# Altium schematic sheet 双电机驱动.SchDoc
size A3
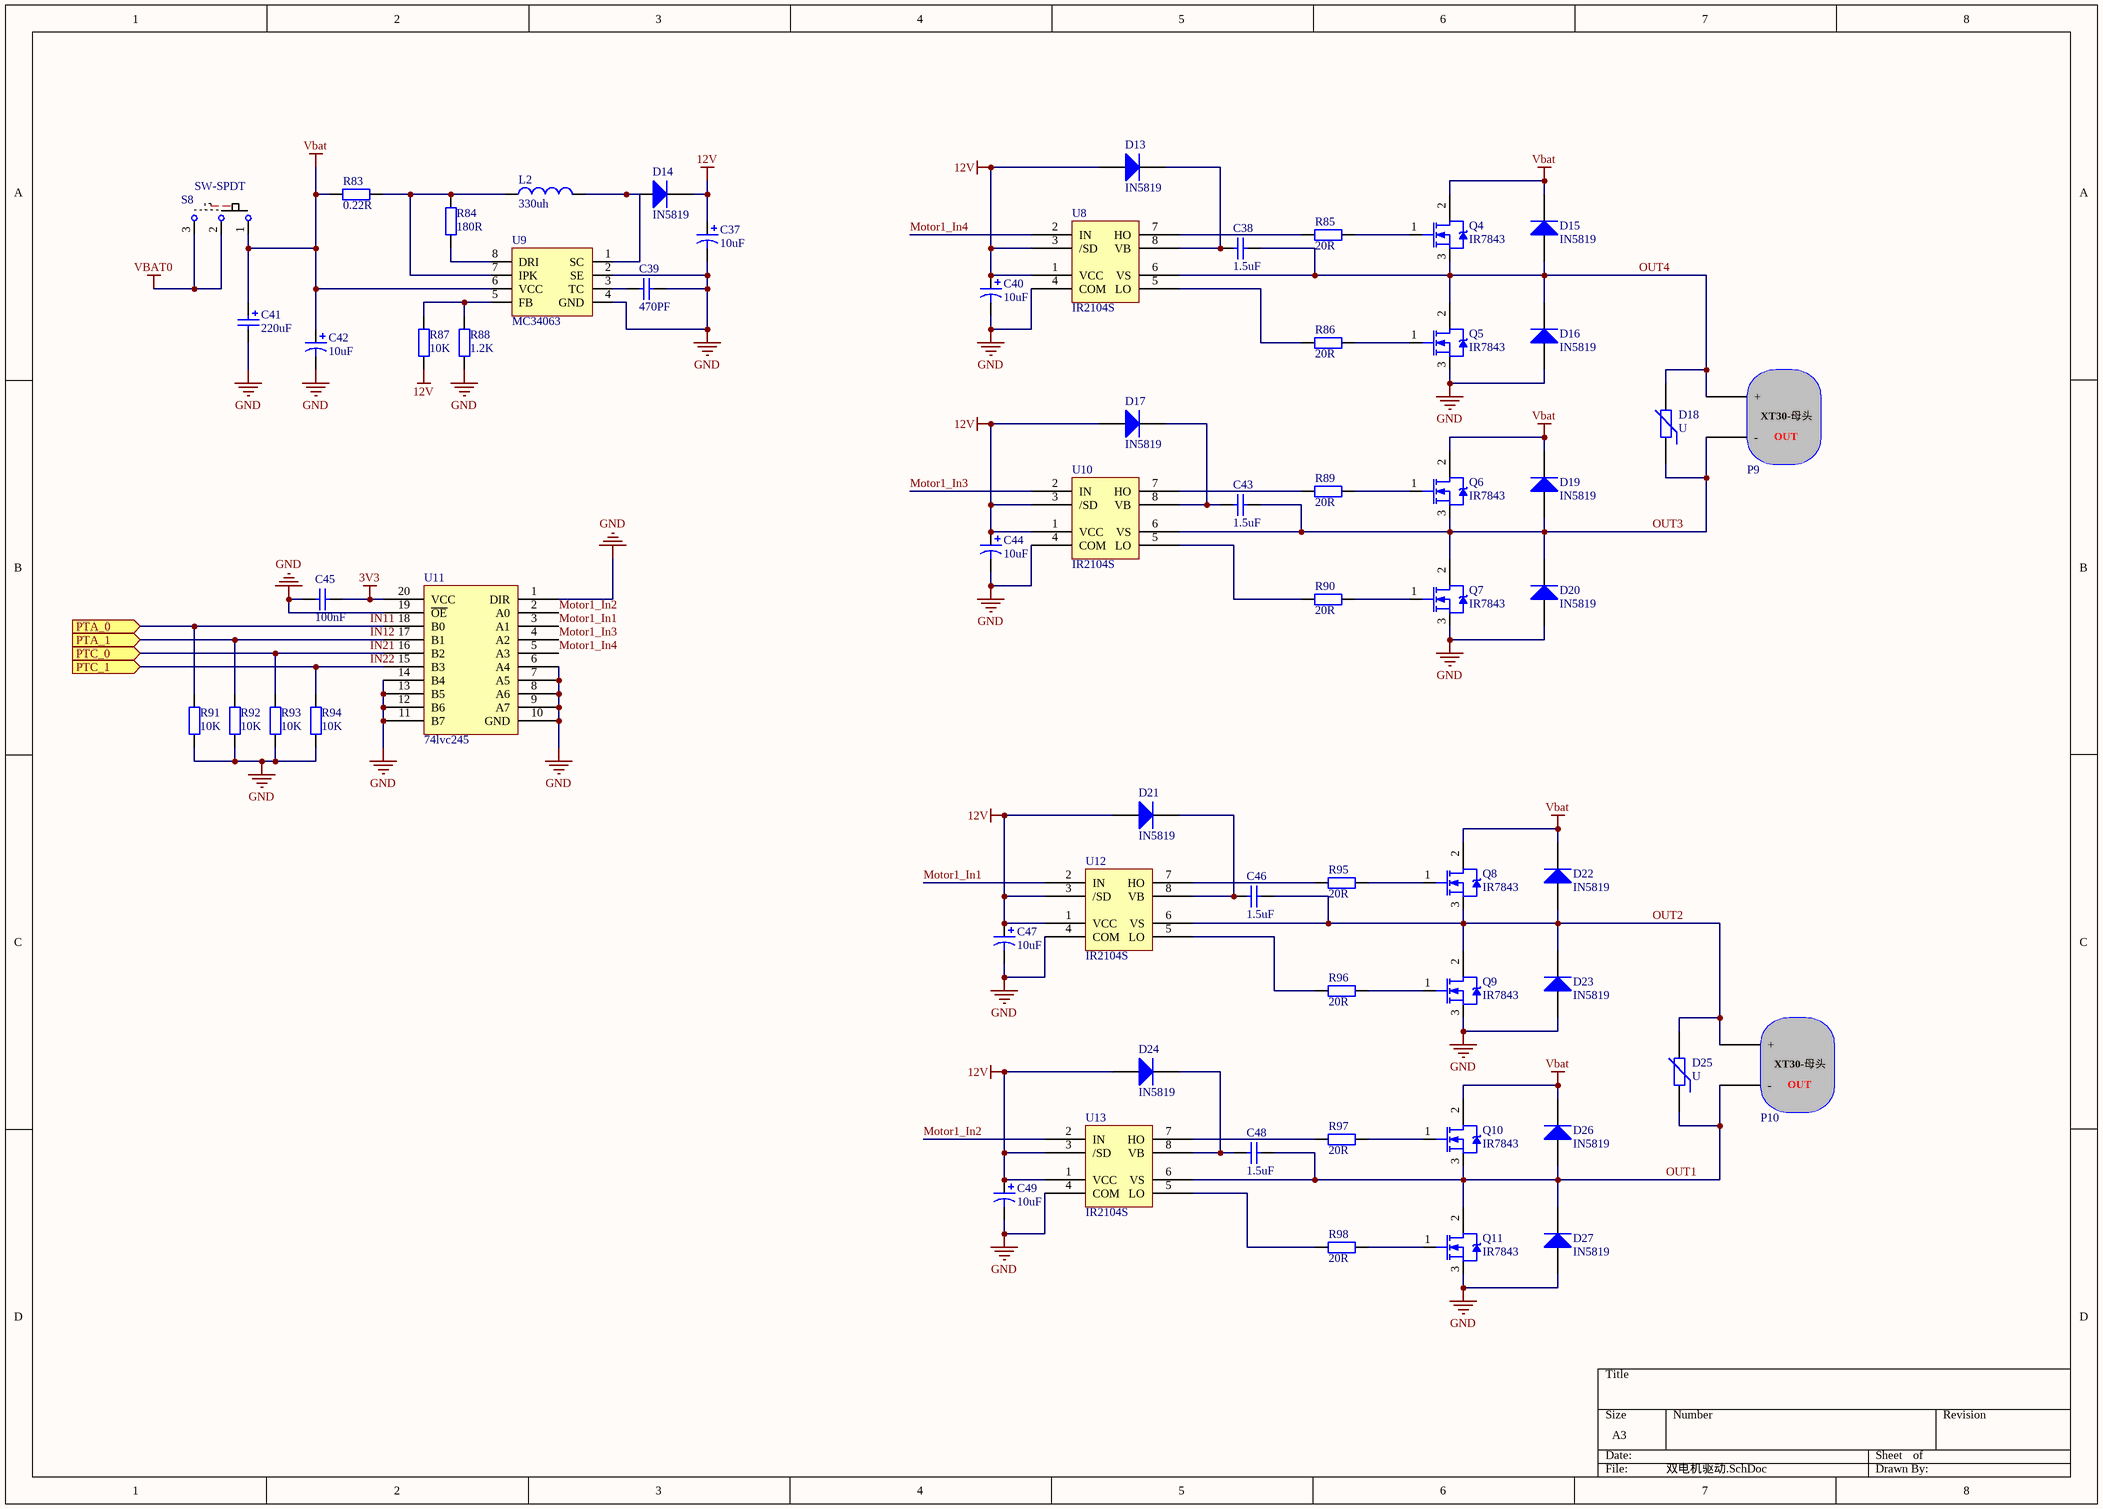
[diagram p0: 双电机驱动.SchDoc]

## Parts
C37  10uF  [1206C]
C38  1.5uF  [0805(2012)]
C39  470PF  [0805(2012)]
C40  10uF  [1206C]
C41  220uF  [AEC_D6.3]
C42  10uF  [1206C]
C43  1.5uF  [0805(2012)]
C44  10uF  [1206C]
C45  100nF  [0805]
C46  1.5uF  [0805(2012)]
C47  10uF  [1206C]
C48  1.5uF  [0805(2012)]
C49  10uF  [1206C]
D13  IN5819  [Diode-1206]
D14  IN5819  [SMB]
D15  IN5819  [SMB]
D16  IN5819  [SMB]
D17  IN5819  [Diode-1206]
D18  U  [0805(2012)]
D19  IN5819  [SMB]
D20  IN5819  [SMB]
D21  IN5819  [Diode-1206]
D22  IN5819  [SMB]
D23  IN5819  [SMB]
D24  IN5819  [Diode-1206]
D25  U  [0805(2012)]
D26  IN5819  [SMB]
D27  IN5819  [SMB]
L2  value 330uh  [电感8*8_0]  (hidden comment: Inductor)
P9  XT30-母-pcb  [XT30-垂直]  (value not drawn)
P10  XT30-母-pcb  [XT30-垂直]  (value not drawn)
Q4  IR7843  [LR7843_0]
Q5  IR7843  [LR7843_0]
Q6  IR7843  [LR7843_0]
Q7  IR7843  [LR7843_0]
Q8  IR7843  [LR7843_0]
Q9  IR7843  [LR7843_0]
Q10  IR7843  [LR7843_0]
Q11  IR7843  [LR7843_0]
R83  0.22R  [0805]
R84  180R  [0805]
R85  20R  [0805]
R86  20R  [0805]
R87  10K  [0805]
R88  1.2K  [0805]
R89  20R  [0805]
R90  20R  [0805]
R91  10K  [0805]
R92  10K  [0805]
R93  10K  [0805]
R94  10K  [0805]
R95  20R  [0805]
R96  20R  [0805]
R97  20R  [0805]
R98  20R  [0805]
S8  SW-SPDT  [SWICH_2]
U8  IR2104S  [IR2104]
U9  MC34063  [MC34063]
U10  IR2104S  [IR2104]
U11  74lvc245  [74lvc245 TSSOP]
U12  IR2104S  [IR2104]
U13  IR2104S  [IR2104]

## Ports
PTA_0 (in), PTA_1 (in), PTC_0 (in), PTC_1 (in)

## Nets
3V3: C45.2 U11.20(VCC)
12V: C37.1 C40.1 C44.1 C47.1 C49.1 D13.1(A) D14.2(K) D17.1(A) D21.1(A) D24.1(A) R87.2 U8.1(VCC) U8.3(/SD) U10.1(VCC) U10.3(/SD) U12.1(VCC) U12.3(/SD) U13.1(VCC) U13.3(/SD)
GND: C37.2 C39.1 C40.2 C41.2 C42.2 C44.2 C45.1 C47.2 C49.2 D16.1(A) D20.1(A) D23.1(A) D27.1(A) Q5.3(S) Q7.3(S) Q9.3(S) Q11.3(S) R88.2 R91.1 R92.1 R93.1 R94.1 U8.4(COM) U9.2(SE) U9.4(GND) U10.4(COM) U11.1(DIR) U11.6(A4) U11.7(A5) U11.8(A6) U11.9(A7) U11.10(GND) U11.11(B7) U11.12(B6) U11.13(B5) U11.14(B4) U11.19(~{OE}) U12.4(COM) U13.4(COM)
Vbat: C41.1 C42.1 D15.2(K) D19.2(K) D22.2(K) D26.2(K) Q4.2(D) Q6.2(D) Q8.2(D) Q10.2(D) R83.2 S8.1 U9.6(VCC)
VBAT0: S8.2 S8.3
IN11: R91.2 U11.18(B0) ; port PTA_0
IN12: R92.2 U11.17(B1) ; port PTA_1
IN21: R93.2 U11.16(B2) ; port PTC_0
IN22: R94.2 U11.15(B3) ; port PTC_1
Motor1_In1: U11.3(A1) U12.2(IN)
Motor1_In2: U11.2(A0) U13.2(IN)
Motor1_In3: U10.2(IN) U11.4(A2)
Motor1_In4: U8.2(IN) U11.5(A3)
OUT1: C48.2 D25.1 D26.1(A) D27.2(K) P10.1(-) Q10.3(S) Q11.2(D) U13.6(VS)
OUT2: C46.2 D22.1(A) D23.2(K) D25.2 P10.0(+) Q8.3(S) Q9.2(D) U12.6(VS)
OUT3: C43.2 D18.1 D19.1(A) D20.2(K) P9.1(-) Q6.3(S) Q7.2(D) U10.6(VS)
OUT4: C38.2 D15.1(A) D16.2(K) D18.2 P9.0(+) Q4.3(S) Q5.2(D) U8.6(VS)
NetC38_1: C38.1 D13.2(K) U8.8(VB)
NetC39_2: C39.2 U9.3(TC)
NetC43_1: C43.1 D17.2(K) U10.8(VB)
NetC46_1: C46.1 D21.2(K) U12.8(VB)
NetC48_1: C48.1 D24.2(K) U13.8(VB)
NetD14_1: D14.1(A) L2.2 U9.1(SC)
NetL2_1: L2.1 R83.1 R84.2 U9.7(IPK)
NetQ4_1: Q4.1(G) R85.2
NetQ5_1: Q5.1(G) R86.2
NetQ6_1: Q6.1(G) R89.2
NetQ7_1: Q7.1(G) R90.2
NetQ8_1: Q8.1(G) R95.2
NetQ9_1: Q9.1(G) R96.2
NetQ10_1: Q10.1(G) R97.2
NetQ11_1: Q11.1(G) R98.2
NetR84_1: R84.1 U9.8(DRI)
NetR85_1: R85.1 U8.7(HO)
NetR86_1: R86.1 U8.5(LO)
NetR87_1: R87.1 R88.1 U9.5(FB)
NetR89_1: R89.1 U10.7(HO)
NetR90_1: R90.1 U10.5(LO)
NetR95_1: R95.1 U12.7(HO)
NetR96_1: R96.1 U12.5(LO)
NetR97_1: R97.1 U13.7(HO)
NetR98_1: R98.1 U13.5(LO)

## Notes on the sheet
- (in symbol XT30-母头) OUT

## Library data of the parts
C37 C40-C42 C44 C47 C49 = Cap Pol1: Polarized Capacitor (Radial)
  C37 C40 C42 C44 C47 C49: Published: 8-Jun-2000; LatestRevisionDate: 17-Jul-2002; LatestRevisionNote: Re-released for DXP Platform.; PackageReference: RB7.6-15; Publisher: Altium Limited; PackageDescription: Polarized Capacitor (Radial); 2 Leads; Value: 10uF
C38 C39 C43 C45 C46 C48 = Cap: Capacitor
  C38 C43 C46 C48: Published: 8-Jun-2000; LatestRevisionDate: 17-Jul-2002; LatestRevisionNote: Re-released for DXP Platform.; PackageReference: RAD-0.3; Publisher: Altium Limited; PackageDescription: Radial Cap, Thru-Hole; 2 Leads; 0.3 in Pin Spacing; Value: 1.5uF
  C39: Published: 8-Jun-2000; LatestRevisionDate: 17-Jul-2002; LatestRevisionNote: Re-released for DXP Platform.; PackageReference: RAD-0.3; Publisher: Altium Limited; PackageDescription: Radial Cap, Thru-Hole; 2 Leads; 0.3 in Pin Spacing; Value: 470PF
D13-D17 D19-D24 D26 D27 = Diode: Default Diode; PackageVersion: Sep-1996; PackageDescription: DO-214-AB/SMC; 2 C-Bend Leads; Body 7.9 x 5.9 mm, inc. leads (LxW); Code_JEDEC: DO-214-AB
D18 D25 = Res Varistor: Varistor (Voltage-Sensitive Resistor); Published: 24-Mar-1999; LatestRevisionDate: 29-May-2009; LatestRevisionNote: IPC-7351 Footprint Added.; PackageVersion: Mar-2003; PackageReference: 6-0805; Publisher: Altium Limited; PackageDescription: Chip Resistor 0805 Case Size; Code_IPC: RESC2012
L2 = Inductor: Code_IEC: 1005; Published: 8-Jun-2000; LatestRevisionDate: 29-May-2009; LatestRevisionNote: IPC-7351 Footprint Added.; PackageReference: 0402-A; Publisher: Altium Limited; PackageDescription: Chip Inductor; Code_JEITA: 0402
P9 P10 = XT30-母头
Q4-Q11 = NMOS-2: N-Channel Power MOSFET; Note: Pin 2 is electrically connected to pin 4.; Published: 8-Jun-2000; LatestRevisionDate: 17-Jul-2002; LatestRevisionNote: Re-released for DXP Platform.; DatasheetVersion: PD-9.814; PackageVersion: Feb-1997; PackageReference: TO-220AB; Publisher: Altium Limited; PackageDescription: TO, Thru-Hole, Vertical, Heatsink Mounted; 3 In-Line Leads; Pitch 2.54 mm; ComponentLink1Description: Manufacturer Link; ComponentLink1URL: http://www.irf.com/
R83-R98 = Res: Resistor
S8 = SW-SPDT: SPDT Subminiature Toggle Switch, Right Angle Mounting, Vertical Actuation
U8 U10 U12 U13 = Component_1_1
U9 = 74HC00
U11 = 74lvc245: 8位5伏转3.3伏电平转换芯片